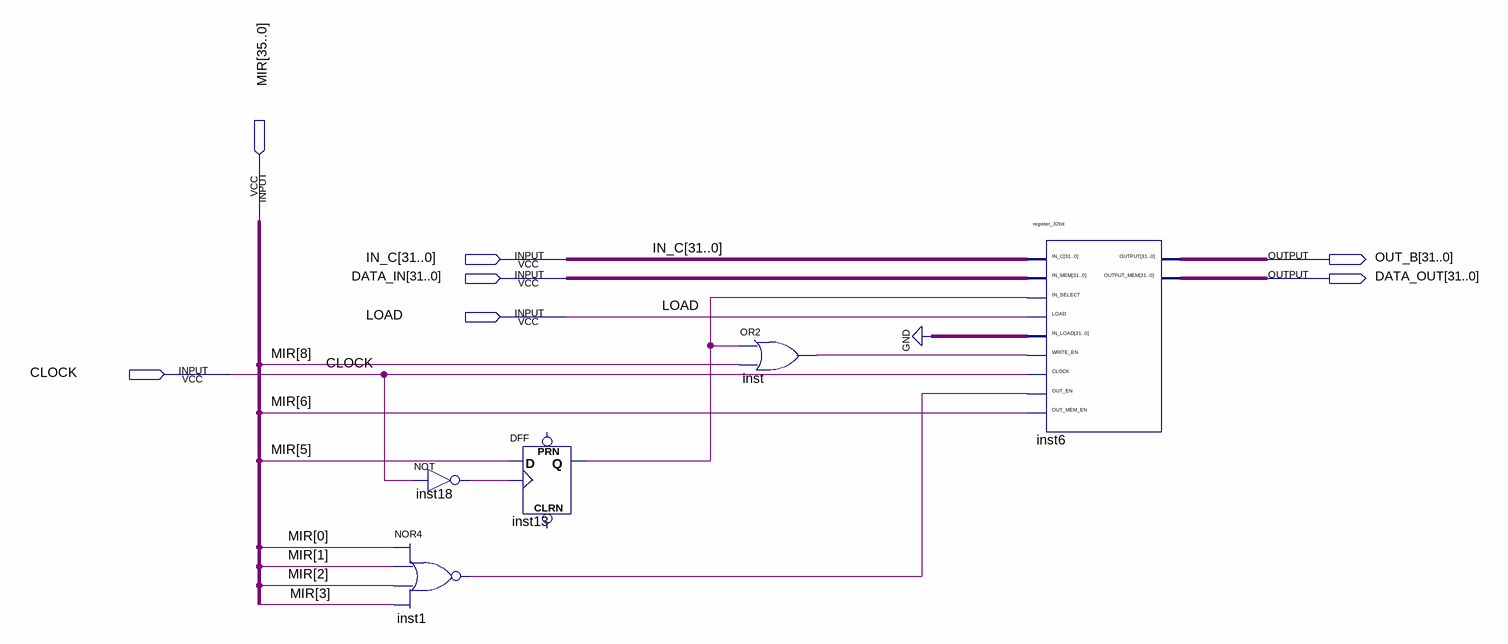
[diagram p0: schematic sheet]
// Quartus schematic MDR.bdf as structural Verilog: 5 symbols, 7 pins
module MDR (
  input  [35:0] MIR,
  input  [31:0] IN_C,
  input  [31:0] DATA_IN,
  input  LOAD,
  input  CLOCK,
  output [31:0] OUT_B,
  output [31:0] DATA_OUT
);

  wire inst1_out, inst13_q, inst18_out, inst_out;

  not inst18 (inst18_out, CLOCK);
  nor inst1 (inst1_out, MIR[0], MIR[1], MIR[2], MIR[3]);
  DFF inst13 (.CLK(inst18_out), .D(MIR[5]), .Q(inst13_q));  // open: CLRN, PRN
  or inst (inst_out, inst13_q, MIR[8]);
  register_32bit inst6 (
    .IN_LOAD({32{1'b0}}), .IN_C(IN_C), .LOAD(LOAD), .IN_MEM(DATA_IN), .IN_SELECT(inst13_q),
    .WRITE_EN(inst_out), .CLOCK(CLOCK), .OUT_EN(inst1_out), .OUT_MEM_EN(MIR[6]), .OUTPUT(OUT_B),
    .OUTPUT_MEM(DATA_OUT));
endmodule
